# EAGLE design SlotExtenderConverter_Slot50 (EAGLE 7.5.0)
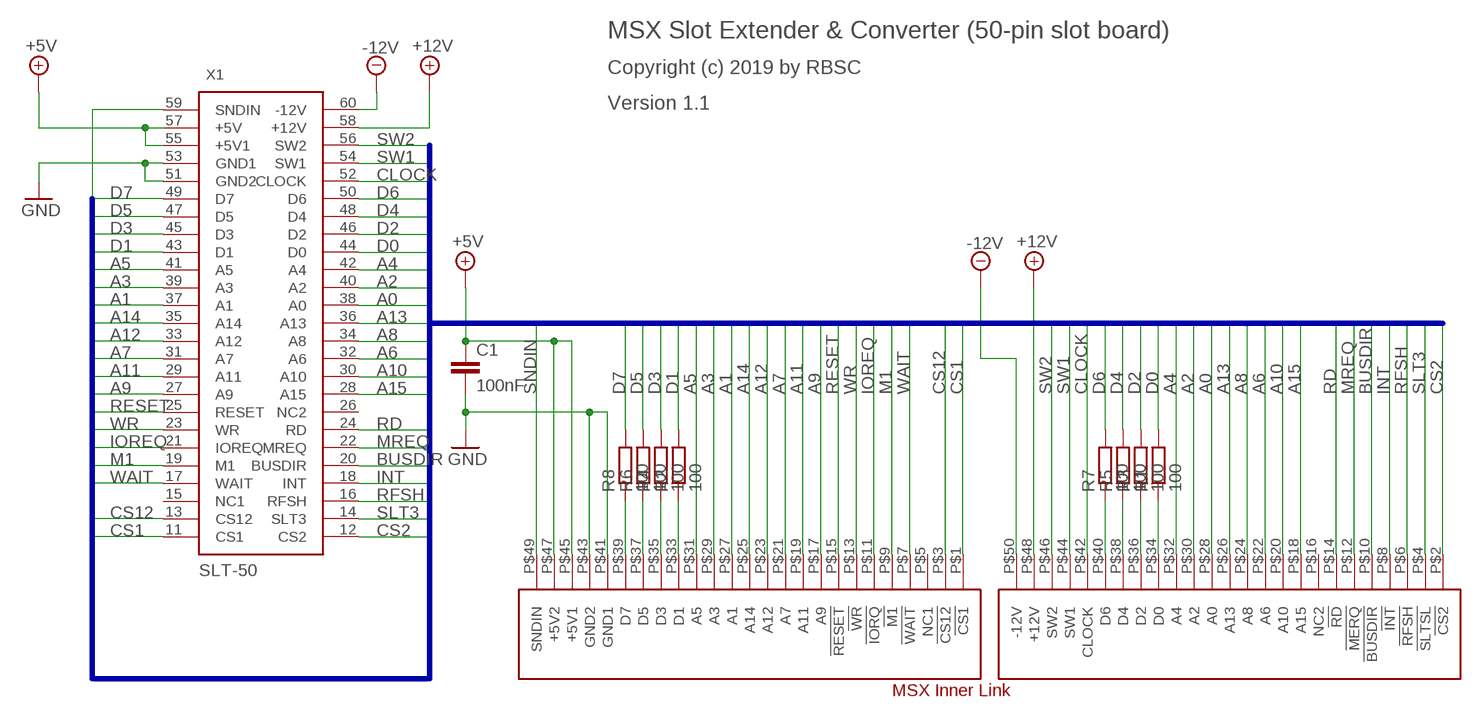
[diagram p0: schematic, sheet 1]

## Parts
C1  100nF  C-EUC0805K  [C0805K]
CN3  MSX_INNER_LINK  [MSX_INNER_LINK]
R1  100  R-EU_M0805  [M0805]
R2  100  R-EU_M0805  [M0805]
R3  100  R-EU_M0805  [M0805]
R4  100  R-EU_M0805  [M0805]
R5  100  R-EU_M0805  [M0805]
R6  100  R-EU_M0805  [M0805]
R7  100  R-EU_M0805  [M0805]
R8  100  R-EU_M0805  [M0805]
X1  SLT-50  [SLT-50]

## Nets
+5V: C1.1 CN3.P$45(+5V1) CN3.P$47(+5V2) X1.55(+5V1) X1.57(+5V)
+12V: CN3.P$48(+12V) X1.58(+12V)
-12V: CN3.P$50(-12V) X1.60(-12V)
A0: CN3.P$28(A0) X1.38(A0)
A1: CN3.P$27(A1) X1.37(A1)
A2: CN3.P$30(A2) X1.40(A2)
A3: CN3.P$29(A3) X1.39(A3)
A4: CN3.P$32(A4) X1.42(A4)
A5: CN3.P$31(A5) X1.41(A5)
A6: CN3.P$22(A6) X1.32(A6)
A7: CN3.P$21(A7) X1.31(A7)
A8: CN3.P$24(A8) X1.34(A8)
A9: CN3.P$17(A9) X1.27(A9)
A10: CN3.P$20(A10) X1.30(A10)
A11: CN3.P$19(A11) X1.29(A11)
A12: CN3.P$23(A12) X1.33(A12)
A13: CN3.P$26(A13) X1.36(A13)
A14: CN3.P$25(A14) X1.35(A14)
A15: CN3.P$18(A15) X1.28(A15)
BUSDIR: CN3.P$10(!BUSDIR) X1.20(BUSDIR)
CLOCK: CN3.P$42(CLOCK) X1.52(CLOCK)
CS1: CN3.P$1(!CS1) X1.11(CS1)
CS2: CN3.P$2(!CS2) X1.12(CS2)
CS12: CN3.P$3(!CS12) X1.13(CS12)
D0: R1.2 X1.44(D0)
D1: R2.2 X1.43(D1)
D2: R3.2 X1.46(D2)
D3: R4.2 X1.45(D3)
D4: R5.2 X1.48(D4)
D5: R6.2 X1.47(D5)
D6: R7.2 X1.50(D6)
D7: R8.2 X1.49(D7)
GND: C1.2 CN3.P$41(GND1) CN3.P$43(GND2) X1.51(GND2) X1.53(GND1)
INT: CN3.P$8(!INT) X1.18(INT)
IOREQ: CN3.P$11(!IORQ) X1.21(IOREQ)
M1: CN3.P$9(!M1) X1.19(M1)
MREQ: CN3.P$12(!MERQ) X1.22(MREQ)
N$1: CN3.P$40(D6) R7.1
N$2: CN3.P$39(D7) R8.1
N$3: CN3.P$37(D5) R6.1
N$4: CN3.P$35(D3) R4.1
N$5: CN3.P$33(D1) R2.1
N$6: CN3.P$38(D4) R5.1
N$7: CN3.P$36(D2) R3.1
N$8: CN3.P$34(D0) R1.1
RD: CN3.P$14(!RD) X1.24(RD)
RESET: CN3.P$15(!RESET) X1.25(RESET)
RFSH: CN3.P$6(!RFSH) X1.16(RFSH)
SLT3: CN3.P$4(!SLTSL) X1.14(SLT3)
SNDIN: CN3.P$49(SNDIN) X1.59(SNDIN)
SW1: CN3.P$44(SW1) X1.54(SW1)
SW2: CN3.P$46(SW2) X1.56(SW2)
WAIT: CN3.P$7(!WAIT) X1.17(WAIT)
WR: CN3.P$13(!WR) X1.23(WR)
Unconnected: CN3.P$5(NC1) CN3.P$16(NC2) X1.15(NC1) X1.26(NC2)

## Buses
D0,D1,D2,D3,D4,D5,D6,D7,A0,A1,A2,A3,A4,A5,A6,A7,A8,A9,A10,A11,A12,A13,A14,A15,CS1,CS2,CS12,SLT3,RFSH,WAIT,INT,M1,BUSDIR,IOREQ,MREQ,WR,RD,RESET,GND,CLOCK,SW1,SW2,SNDIN

## Notes on the sheet
- MSX Slot Extender & Converter (50-pin slot board)
- Copyright (c) 2019 by RBSC
- Version 1.1

## Library data of the parts
C1 = rcl:C-EU: CAPACITOR, European symbol
CN3 = msx_inner_link:MSX_INNER_LINK
R1-R8 = resistor:R-EU_: RESISTOR, European symbol
X1 = slt-50:SLT-50: 50-pin connector side slot

## Board
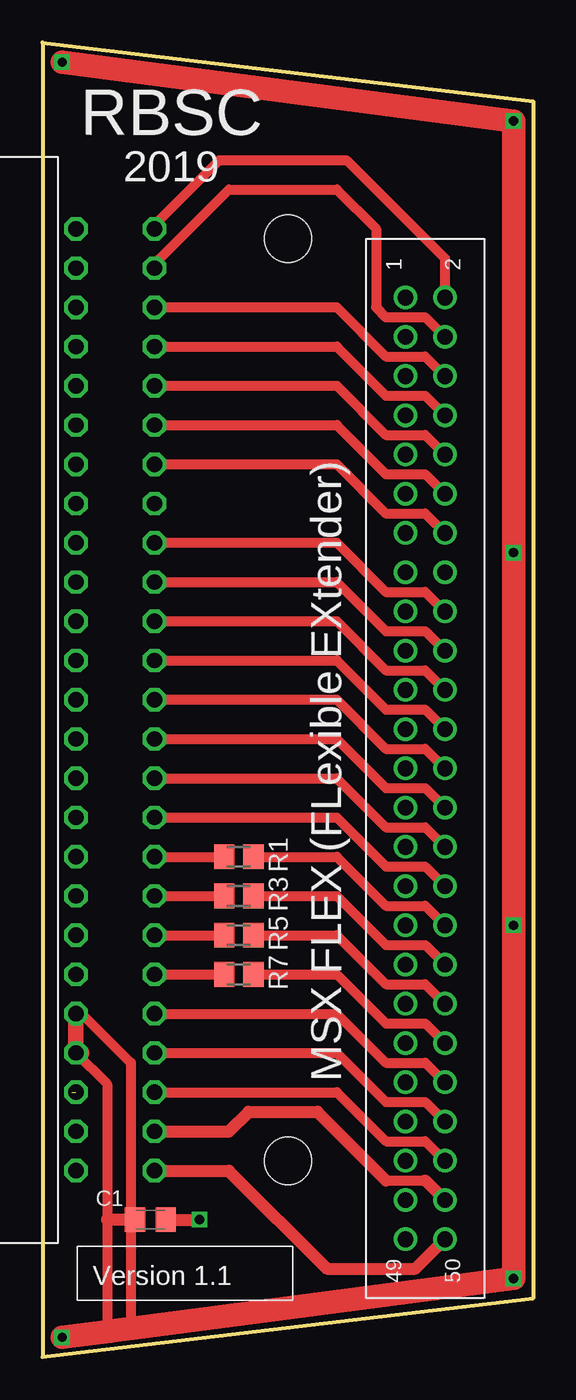
[diagram p1: board, top side]
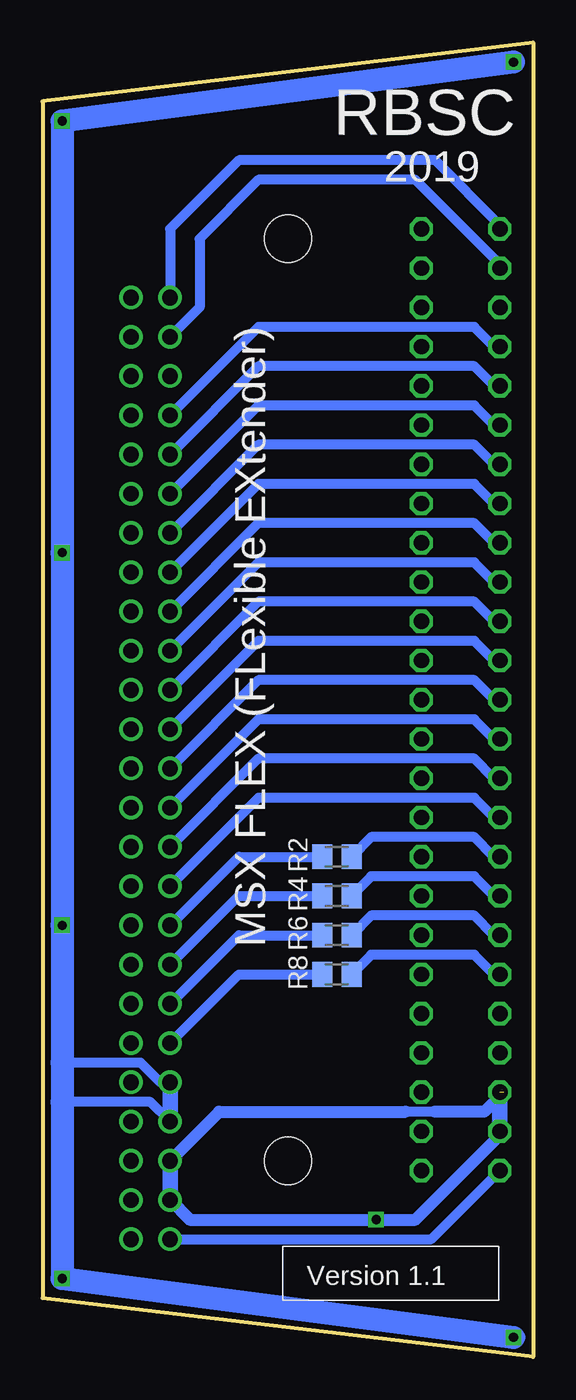
[diagram p2: board, bottom side, seen from below]

Size 31.75 x 85.09 mm. Coordinates in mm from the lower left corner, seen from the top.
Outline: 0,85.09 0,0 31.75,3.81 31.75,81.28 0,85.09
Copper layers (1*16): Top 0.035mm / dielectric 1.5mm / Bottom 0.035mm
Design rules "default *": minimum track width 10mil, minimum drill 24mil, track to track 7mil, track to pad 8mil, pad to pad 8mil, via to via 8mil, smd to smd 8mil, copper to edge 4mil, drill to drill 8mil, minimum pad ring 10mil, minimum via ring 8mil, stop-mask expansion 4mil, vias tented up to drill 24mil, thermal gap 10mil
Holes 3.05 mm at 15.88,12.7 15.88,72.39

### Footprints (pad centres in the part's own frame; a part is rotated, then mirrored left to right if it is on the bottom)
C0805K = smd 1.3 x 1.6: 1 -1,0; 2 1,0
MSX_INNER_LINK = drill 1.016: P$1 63.5,5.08; P$2 63.5,2.54; P$3 60.96,5.08; P$4 60.96,2.54; P$5 58.42,5.08; P$6 58.42,2.54; P$7 55.88,5.08; P$8 55.88,2.54; P$9 53.34,5.08; P$10 53.34,2.54; P$11 50.8,5.08; P$12 50.8,2.54; P$13 48.26,5.08; P$14 48.26,2.54; P$15 45.72,5.08; P$16 45.72,2.54; P$17 43.18,5.08; P$18 43.18,2.54; P$19 40.64,5.08; P$20 40.64,2.54; P$21 38.1,5.08; P$22 38.1,2.54; P$23 35.56,5.08; P$24 35.56,2.54; P$25 33.02,5.08; P$26 33.02,2.54; P$27 30.48,5.08; P$28 30.48,2.54; P$29 27.94,5.08; P$30 27.94,2.54; P$31 25.4,5.08; P$32 25.4,2.54; P$33 22.86,5.08; P$34 22.86,2.54; P$35 20.32,5.08; P$36 20.32,2.54; P$37 17.78,5.08; P$38 17.78,2.54; P$39 15.24,5.08; P$40 15.24,2.54; P$41 12.7,5.08; P$42 12.7,2.54; P$43 10.16,5.08; P$44 10.16,2.54; P$45 7.62,5.08; P$46 7.62,2.54; P$47 5.08,5.08; P$48 5.08,2.54; P$49 2.54,5.08; P$50 2.54,2.54
M0805 = smd 1.3 x 1.6: 1 -0.95,0; 2 0.95,0
SLT-50 = drill 1 octagon: 11 -24.13,6.35; 12 -24.13,1.27; 13 -21.59,6.35; 14 -21.59,1.27; 15 -19.05,6.35; 16 -19.05,1.27; 17 -16.51,6.35; 18 -16.51,1.27; 19 -13.97,6.35; 20 -13.97,1.27; 21 -11.43,6.35; 22 -11.43,1.27; 23 -8.89,6.35; 24 -8.89,1.27; 25 -6.35,6.35; 26 -6.35,1.27; 27 -3.81,6.35; 28 -3.81,1.27; 29 -1.27,6.35; 30 -1.27,1.27; 31 1.27,6.35; 32 1.27,1.27; 33 3.81,6.35; 34 3.81,1.27; 35 6.35,6.35; 36 6.35,1.27; 37 8.89,6.35; 38 8.89,1.27; 39 11.43,6.35; 40 11.43,1.27; 41 13.97,6.35; 42 13.97,1.27; 43 16.51,6.35; 44 16.51,1.27; 45 19.05,6.35; 46 19.05,1.27; 47 21.59,6.35; 48 21.59,1.27; 49 24.13,6.35; 50 24.13,1.27; 51 26.67,6.35; 52 26.67,1.27; 53 29.21,6.35; 54 29.21,1.27; 55 31.75,6.35; 56 31.75,1.27; 57 34.29,6.35; 58 34.29,1.27; 59 36.83,6.35; 60 36.83,1.27

### Placement (x,y rotation side)
C1  6.99,8.89 180 top
CN3  28.57,5.08 90 top
R1  12.7,32.38 180 top
R2  12.7,32.38 0 bottom
R3  12.7,29.84 180 top
R4  12.7,29.84 0 bottom
R5  12.7,27.3 180 top
R6  12.7,27.3 0 bottom
R7  12.7,24.77 180 top
R8  12.7,24.77 0 bottom
X1  8.51,48.9 270 bottom

### Tracks (layer width: path | path; a pad name or v marks a point on that pad's centre or on a via)
+5V  (via drill 0.6)  (1 unrouted)
  Top 0.762: C1.1 v10.16,8.89
  Bottom 0.635: 6.35,15.88 8.26,15.88
  Bottom 0.762: CN3.P$45 20.32,15.88 8.26,15.88 | CN3.P$47 22.23,8.89 v10.16,8.89 7.62,8.89 1.91,14.61 | 1.91,17.14 3.17,15.88 6.35,15.88
  Bottom 1.016: CN3.P$47 CN3.P$45 | X1.55 X1.57
+12V
  Top 0.635: 22.23,11.43 24.77,11.43
  Top 0.762: X1.58 12.06,14.61 13.34,15.88 17.78,15.88 22.23,11.43 | 24.77,11.43 CN3.P$48
-12V
  Top 0.762: X1.60 12.06,12.06 18.41,5.71 24.13,5.71 CN3.P$50
A0
  Top 0.635: X1.38 19.05,40.01 22.23,36.83 24.77,36.83 CN3.P$28
A1
  Bottom 0.635: X1.37 2.54,40.01 3.81,41.27 17.78,41.27 CN3.P$27
A2
  Top 0.635: X1.40 19.05,37.47 22.23,34.29 24.77,34.29 CN3.P$30
A3
  Bottom 0.635: X1.39 2.54,37.47 3.81,38.73 17.78,38.73 CN3.P$29
A4
  Top 0.635: X1.42 19.05,34.92 22.23,31.75 24.77,31.75 CN3.P$32
A5
  Bottom 0.635: X1.41 2.54,34.92 3.81,36.2 17.78,36.2 CN3.P$31
A6
  Top 0.635: X1.32 19.05,47.62 22.23,44.45 24.77,44.45 CN3.P$22
A7
  Bottom 0.635: X1.31 2.54,47.62 3.81,48.9 17.78,48.9 CN3.P$21
A8
  Top 0.635: X1.34 19.05,45.09 22.23,41.91 24.77,41.91 CN3.P$24
A9
  Bottom 0.635: X1.27 2.54,52.7 3.81,53.98 17.78,53.98 CN3.P$17
A10
  Top 0.635: X1.30 19.05,50.16 22.23,46.99 24.77,46.99 CN3.P$20
A11
  Bottom 0.635: X1.29 2.54,50.16 3.81,51.44 17.78,51.44 CN3.P$19
A12
  Bottom 0.635: X1.33 2.54,45.09 3.81,46.35 17.78,46.35 CN3.P$23
A13
  Top 0.635: X1.36 19.05,42.55 22.23,39.37 24.77,39.37 CN3.P$26
A14
  Bottom 0.635: X1.35 2.54,42.55 3.81,43.81 17.78,43.81 CN3.P$25
A15
  Top 0.635: X1.28 19.05,52.7 22.23,49.53 24.77,49.53 CN3.P$18
BUSDIR
  Top 0.635: X1.20 19.05,62.87 22.23,59.69 24.77,59.69 CN3.P$10
CLOCK
  Top 0.635: X1.52 19.05,22.23 22.23,19.05 24.77,19.05 CN3.P$42
CS1
  Bottom 0.635: X1.11 2.16,73.28 6.35,77.47 19.05,77.47 23.5,73.03 CN3.P$1
CS2
  Top 0.635: X1.12 7.24,73.28 11.43,77.47 19.68,77.47 26.04,71.12 CN3.P$2
CS12
  Bottom 0.635: X1.13 2.16,70.74 7.62,76.2 17.78,76.2 21.59,72.39 21.59,67.94 CN3.P$3
D0
  Top 0.635: X1.44 R1.2
D1
  Bottom 0.635: X1.43 2.54,32.38 3.81,33.66 10.48,33.66 R2.2
D2
  Top 0.635: X1.46 R3.2
D3
  Bottom 0.635: X1.45 2.54,29.84 3.81,31.11 10.48,31.11 R4.2
D4
  Top 0.635: X1.48 R5.2
D5
  Bottom 0.635: X1.47 2.54,27.3 3.81,28.57 10.48,28.57 R6.2
D6
  Top 0.635: X1.50 R7.2
D7
  Bottom 0.635: X1.49 2.54,24.77 3.81,26.04 10.48,26.04 R8.2
GND  (via drill 0.6)
  Top 0.635: 4.81,1.3 3.85,1.61 | X1.53 4.17,17.67 4.17,8.89 4.17,2.02 4.47,1.69 | 5.8,1.86 5.71,1.95 5.71,19.05 2.54,22.23
  Top 0.762: C1.2 4.17,8.89
  Top 1.016: 2.54,19.68 X1.53 X1.51 | 4.45,1.62 4.39,1.68
  Top 1.524: v1.27,1.27 3.85,1.61 4.39,1.68 4.47,1.69 5.8,1.86 v30.48,5.08 v30.48,27.94 v30.48,52.07 v30.48,80.01 v1.27,83.82
  Bottom 0.635: CN3.P$41 24.13,17.78 25.4,19.05 30.48,19.05 | CN3.P$43 24.77,16.51 30.48,16.51
  Bottom 1.016: v1.27,1.27 1,1.27 | CN3.P$43 CN3.P$41
  Bottom 1.5: v1.27,83.82 v30.48,80.01 v30.48,52.07 v30.48,27.94 30.48,19.05 30.48,16.51 v30.48,5.08 v1.27,1.27
INT
  Top 0.635: X1.18 19.05,65.41 22.23,62.23 24.77,62.23 CN3.P$8
IOREQ
  Bottom 0.635: X1.21 2.54,60.33 3.81,61.59 17.78,61.59 CN3.P$11
M1
  Bottom 0.635: X1.19 2.54,62.87 3.81,64.14 17.78,64.14 CN3.P$9
MREQ
  Top 0.635: X1.22 19.05,60.33 22.23,57.15 24.77,57.15 CN3.P$12
N$1
  Top 0.635: R7.1 19.05,24.77 22.23,21.59 24.77,21.59 CN3.P$40
N$2
  Bottom 0.635: CN3.P$39 19.05,24.77 R8.1
N$3
  Bottom 0.635: CN3.P$37 19.05,27.3 R6.1
N$4
  Bottom 0.635: CN3.P$35 19.05,29.84 R4.1
N$5
  Bottom 0.635: CN3.P$33 19.05,32.38 R2.1
N$6
  Top 0.635: R5.1 19.05,27.3 22.23,24.13 24.77,24.13 CN3.P$38
N$7
  Top 0.635: R3.1 19.05,29.84 22.23,26.67 24.77,26.67 CN3.P$36
N$8
  Top 0.635: R1.1 19.05,32.38 22.23,29.21 24.77,29.21 CN3.P$34
RD
  Top 0.635: X1.24 19.05,57.78 22.23,54.61 24.77,54.61 CN3.P$14
RESET
  Bottom 0.635: X1.25 2.54,55.24 3.81,56.52 17.78,56.52 CN3.P$15
RFSH
  Top 0.635: X1.16 19.05,67.94 22.23,64.77 24.77,64.77 CN3.P$6
SLT3
  Top 0.635: X1.14 7.24,70.74 12.06,75.56 19.05,75.56 21.59,73.03 21.59,67.94 22.23,67.31 24.77,67.31 CN3.P$4
SNDIN
  Bottom 0.635: CN3.P$49 6.6,7.62 X1.59
SW1
  Top 0.635: X1.54 19.05,19.68 22.23,16.51 24.77,16.51 CN3.P$44
SW2
  Top 0.635: X1.56 19.05,17.14 22.23,13.97 24.77,13.97 CN3.P$46
WAIT
  Bottom 0.635: X1.17 2.54,65.41 3.81,66.67 17.78,66.67 CN3.P$7
WR
  Bottom 0.635: X1.23 2.54,57.78 3.81,59.05 17.78,59.05 CN3.P$13

### Text on the board
tNames: RBSC | 2019 | MSX FLEX (FLexible EXtender) | Version 1.1
bNames: RBSC | 2019 | MSX FLEX (FLexible EXtender) | Version 1.1